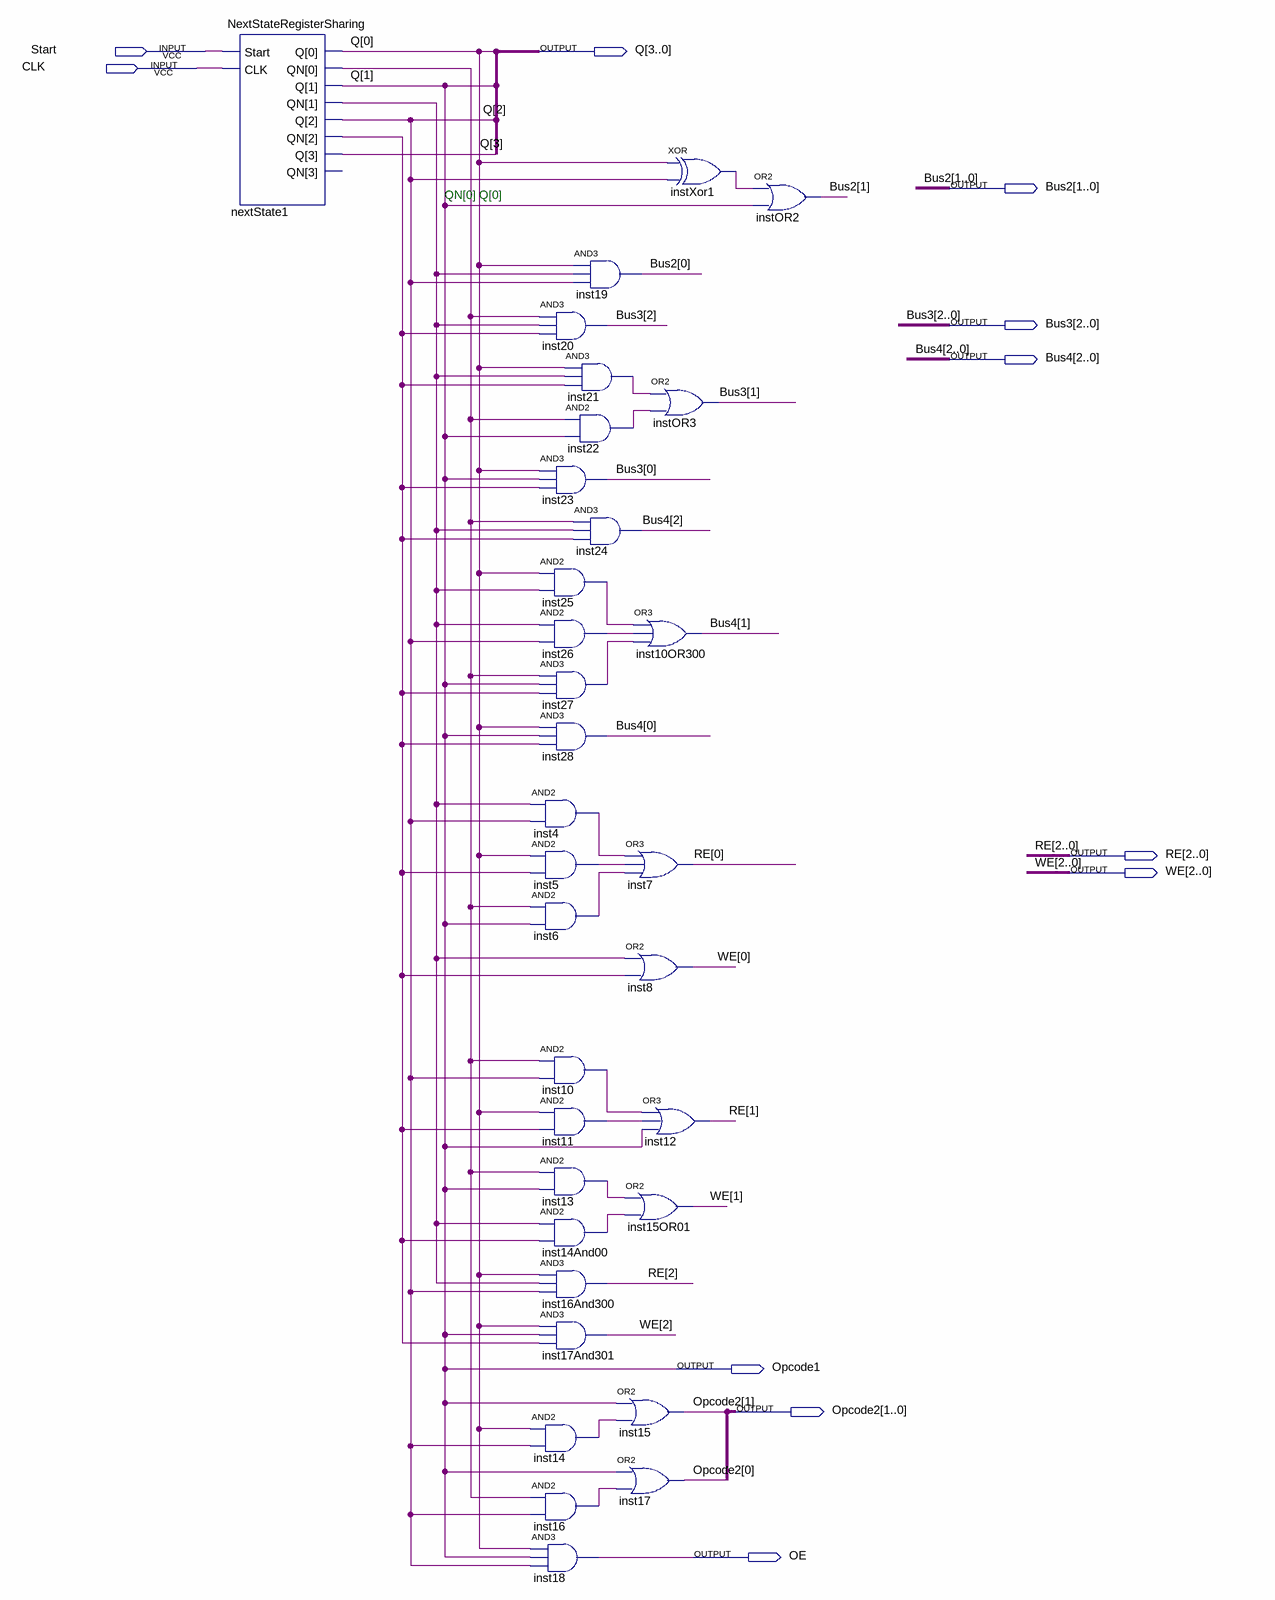
[diagram p0: schematic sheet]
// Quartus schematic ControlBusSharing.bdf as structural Verilog: 33 symbols, 11 pins
module ControlBusSharing (
  input  Start,
  input  CLK,
  output [3:0] Q,
  output [1:0] Bus2,
  output [2:0] Bus3,
  output [2:0] Bus4,
  output [2:0] RE,
  output [2:0] WE,
  output Opcode1,
  output [1:0] Opcode2,
  output OE
);

  wire inst4_out, inst5_out, inst6_out, inst10_out, inst11_out, inst13_out, inst14_out, inst14And00_out,
       inst16_out, inst21_out, inst22_out, inst25_out, inst26_out, inst27_out, instXor1_out, nextState1_qn,
       nextState1_qn_2, nextState1_qn_3;
  wire [3:0] nextState1_qn_open;  // unused outputs

  NextStateRegisterSharing nextState1 (
    .Start(Start), .CLK(CLK), .Q({Q[3:2], Opcode1, Q[0]}),
    .QN({nextState1_qn_open[3], nextState1_qn_3, nextState1_qn, nextState1_qn_2}));
  and inst19 (Bus2[0], Q[0], nextState1_qn, Q[2]);
  and inst20 (Bus3[2], nextState1_qn_2, nextState1_qn, nextState1_qn_3);
  and inst21 (inst21_out, Q[0], nextState1_qn, nextState1_qn_3);
  and inst22 (inst22_out, nextState1_qn_2, Opcode1);
  and inst23 (Bus3[0], Q[0], Opcode1, nextState1_qn_3);
  and inst24 (Bus4[2], nextState1_qn_2, nextState1_qn, nextState1_qn_3);
  and inst25 (inst25_out, Q[0], nextState1_qn);
  and inst26 (inst26_out, nextState1_qn, Q[2]);
  and inst27 (inst27_out, nextState1_qn_2, Opcode1, nextState1_qn_3);
  and inst28 (Bus4[0], Q[0], Opcode1, nextState1_qn_3);
  and inst4 (inst4_out, nextState1_qn, Q[2]);
  and inst5 (inst5_out, Q[0], nextState1_qn_3);
  and inst6 (inst6_out, nextState1_qn_2, Opcode1);
  and inst10 (inst10_out, nextState1_qn_2, Q[2]);
  and inst11 (inst11_out, Q[0], nextState1_qn_3);
  and inst13 (inst13_out, nextState1_qn_2, Opcode1);
  and inst14And00 (inst14And00_out, nextState1_qn, nextState1_qn_3);
  and inst16And300 (RE[2], Q[0], nextState1_qn, Q[2]);
  and inst17And301 (WE[2], Q[0], Opcode1, nextState1_qn_3);
  and inst14 (inst14_out, Q[0], Q[2]);
  and inst16 (inst16_out, nextState1_qn_2, Q[2]);
  and inst18 (OE, Q[0], Opcode1, Q[2]);
  or inst10OR300 (Bus4[1], inst25_out, inst26_out, inst27_out);
  or inst7 (RE[0], inst4_out, inst5_out, inst6_out);
  or inst8 (WE[0], nextState1_qn, nextState1_qn_3);
  or inst12 (RE[1], inst10_out, inst11_out, Opcode1);
  or inst15OR01 (WE[1], inst13_out, inst14And00_out);
  or inst15 (Opcode2[1], Opcode1, inst14_out);
  or inst17 (Opcode2[0], Opcode1, inst16_out);
  xor instXor1 (instXor1_out, Q[0], Q[2]);
  or instOR3 (Bus3[1], inst21_out, inst22_out);
  or instOR2 (Bus2[1], instXor1_out, Opcode1);

  assign Q[1] = Opcode1;

  // Notes on the sheet:
  //   QN[0]
  //   Q[0]
endmodule
